# Altium project QuadrotorPCB.PrjPCB
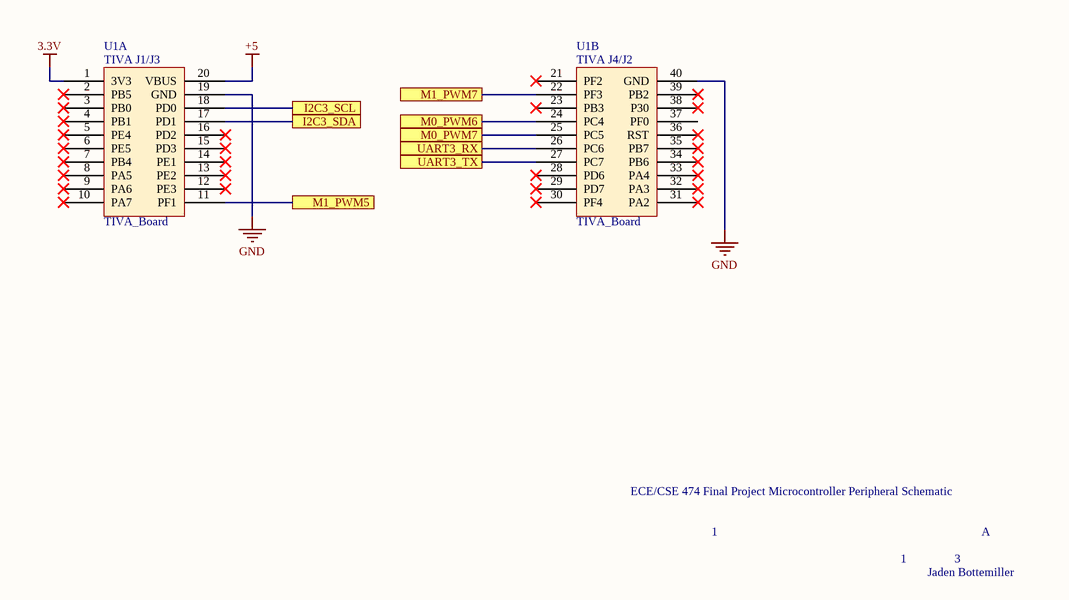
[diagram p0: Microcontroller.SchDoc]
3 sheets, 19 parts. Net scope: flat (ports and power ports of the same name join across sheets).
Board file: QuadrotorPCB.PcbDoc
Sheets:
  Microcontroller.SchDoc
  Sensors.SchDoc
  Power.SchDoc

## Sheet Microcontroller.SchDoc
size A

### Parts
U1  TIVA_Board  [TIVA_AB]  (parts A,B of 2)

### Ports
I2C3_SCL, I2C3_SDA, M0_PWM6, M0_PWM7, M1_PWM5, M1_PWM7, UART3_RX, UART3_TX

### Nets
3.3V: U1.1(3V3)
+5: U1.20(VBUS)
GND: U1.19(GND) U1.40(GND)
NetA1_1: U1.11(PF1) ; port M1_PWM5
NetA2_1: U1.22(PF3) ; port M1_PWM7
NetA3_1: U1.24(PC4) ; port M0_PWM6
NetA4_1: U1.25(PC5) ; port M0_PWM7
NetU1_17: U1.17(PD1) ; port I2C3_SDA
NetU1_18: U1.18(PD0) ; port I2C3_SCL
NetU1_26: U1.26(PC6) ; port UART3_RX
NetU1_27: U1.27(PC7) ; port UART3_TX

Not connected (* = marked no-connect by the designer): U1 2(PB5)* 3(PB0)* 4(PB1)* 5(PE4)* 6(PE5)* 7(PB4)* 8(PA5)* 9(PA6)* 10(PA7)* 12(PE3)* 13(PE2)* 14(PE1)* 15(PD3)* 16(PD2)* 21(PF2)* 23(PB3)* 28(PD6)* 29(PD7)* 30(PF4)* 31(PA2)* 32(PA3)* 33(PA4)* 34(PB6)* 35(PB7)* 36(RST)* 37(PF0) 38(P30)* 39(PB2)*

### Notes on the sheet
- ECE/CSE 474 Final Project Microcontroller Peripheral Schematic
- 1
- 3
- A
- Jaden Bottemiller
- (in symbol TIVA_Board, part A) TIVA J1/J3
- (in symbol TIVA_Board, part B) TIVA J4/J2

## Sheet Sensors.SchDoc
size A
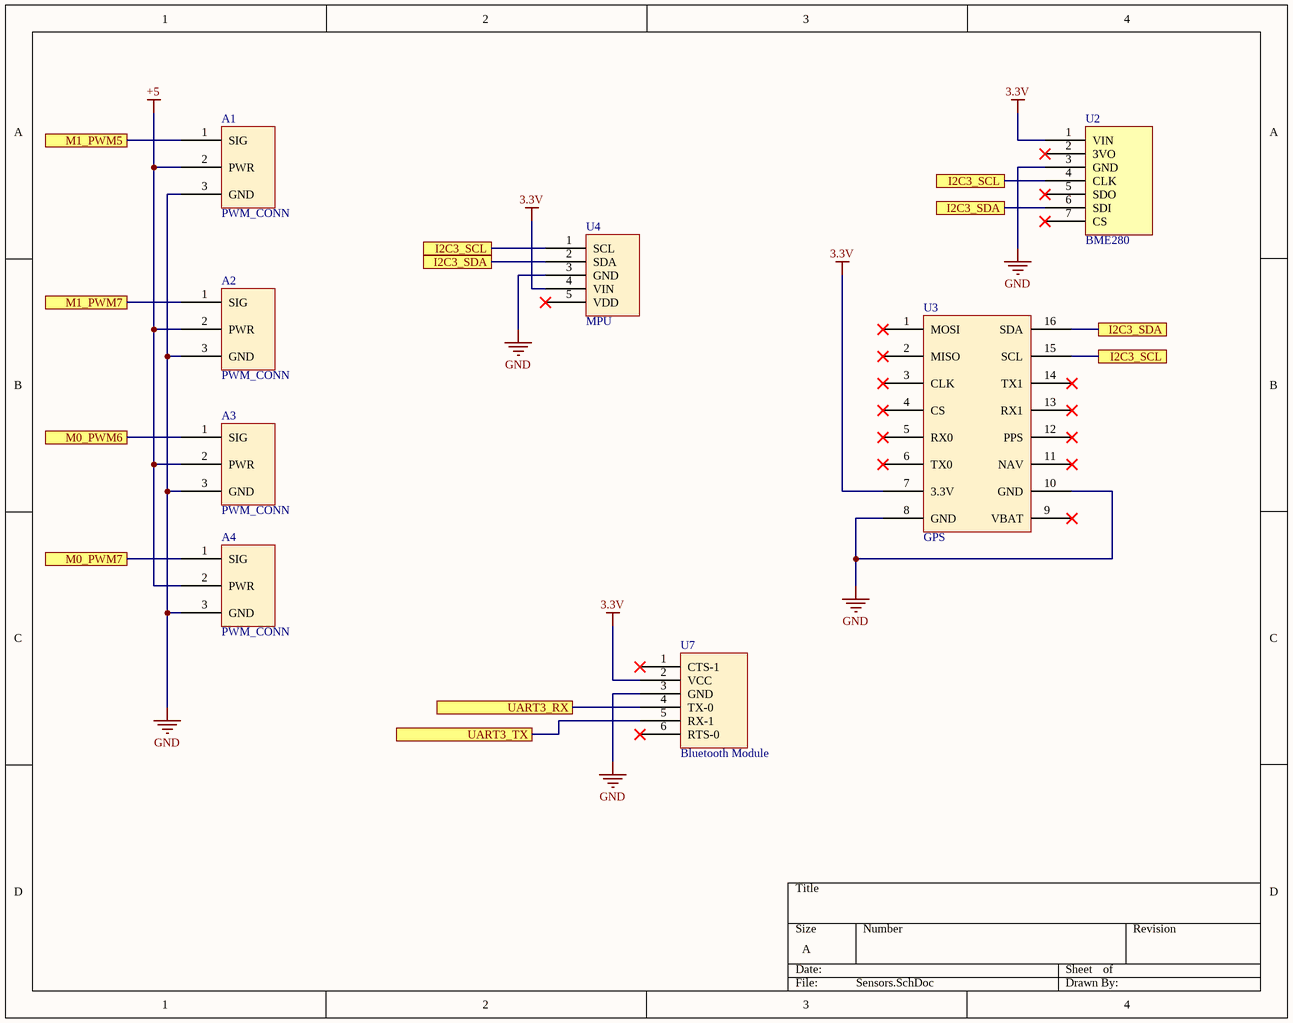
[diagram p1: Sensors.SchDoc]

### Parts
A1  PWM_CONN  [Dupont]
A2  PWM_CONN  [Dupont]
A3  PWM_CONN  [Dupont]
A4  PWM_CONN  [Dupont]
U2  BME280  [BME280]
U3  GPS  [GPS_FOOTPRINT]
U4  MPU  [MPU]
U7  Bluetooth Module  [Bluetooth]

### Ports
I2C3_SCL, I2C3_SDA, M0_PWM6, M0_PWM7, M1_PWM5, M1_PWM7, UART3_RX, UART3_TX

### Nets
3.3V: U2.1(VIN) U3.7(3.3V) U4.4(VIN) U7.2(VCC)
+5: A1.2(PWR) A2.2(PWR) A3.2(PWR) A4.2(PWR)
GND: A1.3(GND) A2.3(GND) A3.3(GND) A4.3(GND) U2.3(GND) U3.8(GND) U3.10(GND) U4.3(GND) U7.3(GND)
NetA1_1: A1.1(SIG) ; port M1_PWM5
NetA2_1: A2.1(SIG) ; port M1_PWM7
NetA3_1: A3.1(SIG) ; port M0_PWM6
NetA4_1: A4.1(SIG) ; port M0_PWM7
NetU1_17: U2.6(SDI) U3.16(SDA) U4.2(SDA) ; port I2C3_SDA
NetU1_18: U2.4(CLK) U3.15(SCL) U4.1(SCL) ; port I2C3_SCL
NetU1_26: U7.4(TX-0) ; port UART3_RX
NetU1_27: U7.5(RX-1) ; port UART3_TX

Not connected (* = marked no-connect by the designer): U2 2(3VO)* 5(SDO)* 7(CS)*; U3 1(MOSI)* 2(MISO)* 3(CLK)* 4(CS)* 5(RX0)* 6(TX0)* 9(VBAT)* 11(NAV)* 12(PPS)* 13(RX1)* 14(TX1)*; U4 5(VDD)*; U7 1(CTS-1)* 6(RTS-0)*

## Sheet Power.SchDoc
size A
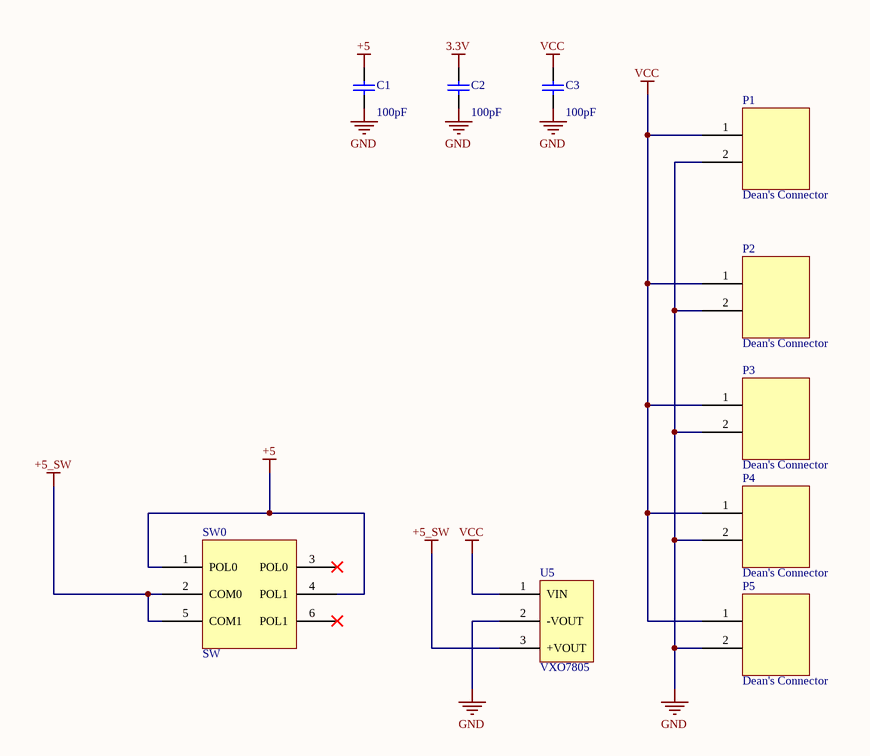
[diagram p2: Power.SchDoc]

### Parts
C1  value 100pF  [C1206]  (hidden comment: Cap Semi)
C2  value 100pF  [C1206]  (hidden comment: Cap Semi)
C3  value 100pF  [C1206]  (hidden comment: Cap Semi)
P1  Dean's Connector  [DEAN_CONN]
P2  Dean's Connector  [DEAN_CONN]
P3  Dean's Connector  [DEAN_CONN]
P4  Dean's Connector  [DEAN_CONN]
P5  Dean's Connector  [DEAN_CONN]
SW0  SW  [SW]
U5  VXO7805  [VXO78-1000]

### Nets
3.3V: C2.2
+5: C1.2 SW0.1(POL0) SW0.4(POL1)
+5_SW: SW0.2(COM0) SW0.5(COM1) U5.3(+VOUT)
GND: C1.1 C2.1 C3.1 P1.2 P2.2 P3.2 P4.2 P5.2 U5.2(-VOUT)
VCC: C3.2 P1.1 P2.1 P3.1 P4.1 P5.1 U5.1(VIN)

Not connected (* = marked no-connect by the designer): SW0 3(POL0)* 6(POL1)*

### Library data of the parts
C1-C3 = Cap Semi: Capacitor (Semiconductor SIM Model); Published: 8-Jun-2000; LatestRevisionDate: 29-May-2009; LatestRevisionNote: IPC-7351 Footprint Added.; PackageReference: C1206; Publisher: Altium Limited; PackageDescription: Chip Capacitor

## Nets that join several sheets
3.3V: Microcontroller (U1.1), Sensors (U2.1 U3.7 U4.4 U7.2), Power (C2.2)
+5: Microcontroller (U1.20), Sensors (A1.2 A2.2 A3.2 A4.2), Power (C1.2 SW0.1 SW0.4)
GND: Microcontroller (U1.19 U1.40), Sensors (9 pins), Power (9 pins)
NetA1_1: Microcontroller (U1.11), Sensors (A1.1)
NetA2_1: Microcontroller (U1.22), Sensors (A2.1)
NetA3_1: Microcontroller (U1.24), Sensors (A3.1)
NetA4_1: Microcontroller (U1.25), Sensors (A4.1)
NetU1_17: Microcontroller (U1.17), Sensors (U2.6 U3.16 U4.2)
NetU1_18: Microcontroller (U1.18), Sensors (U2.4 U3.15 U4.1)
NetU1_26: Microcontroller (U1.26), Sensors (U7.4)
NetU1_27: Microcontroller (U1.27), Sensors (U7.5)